# Altium schematic sheet STM32P100.SchDoc
size A3
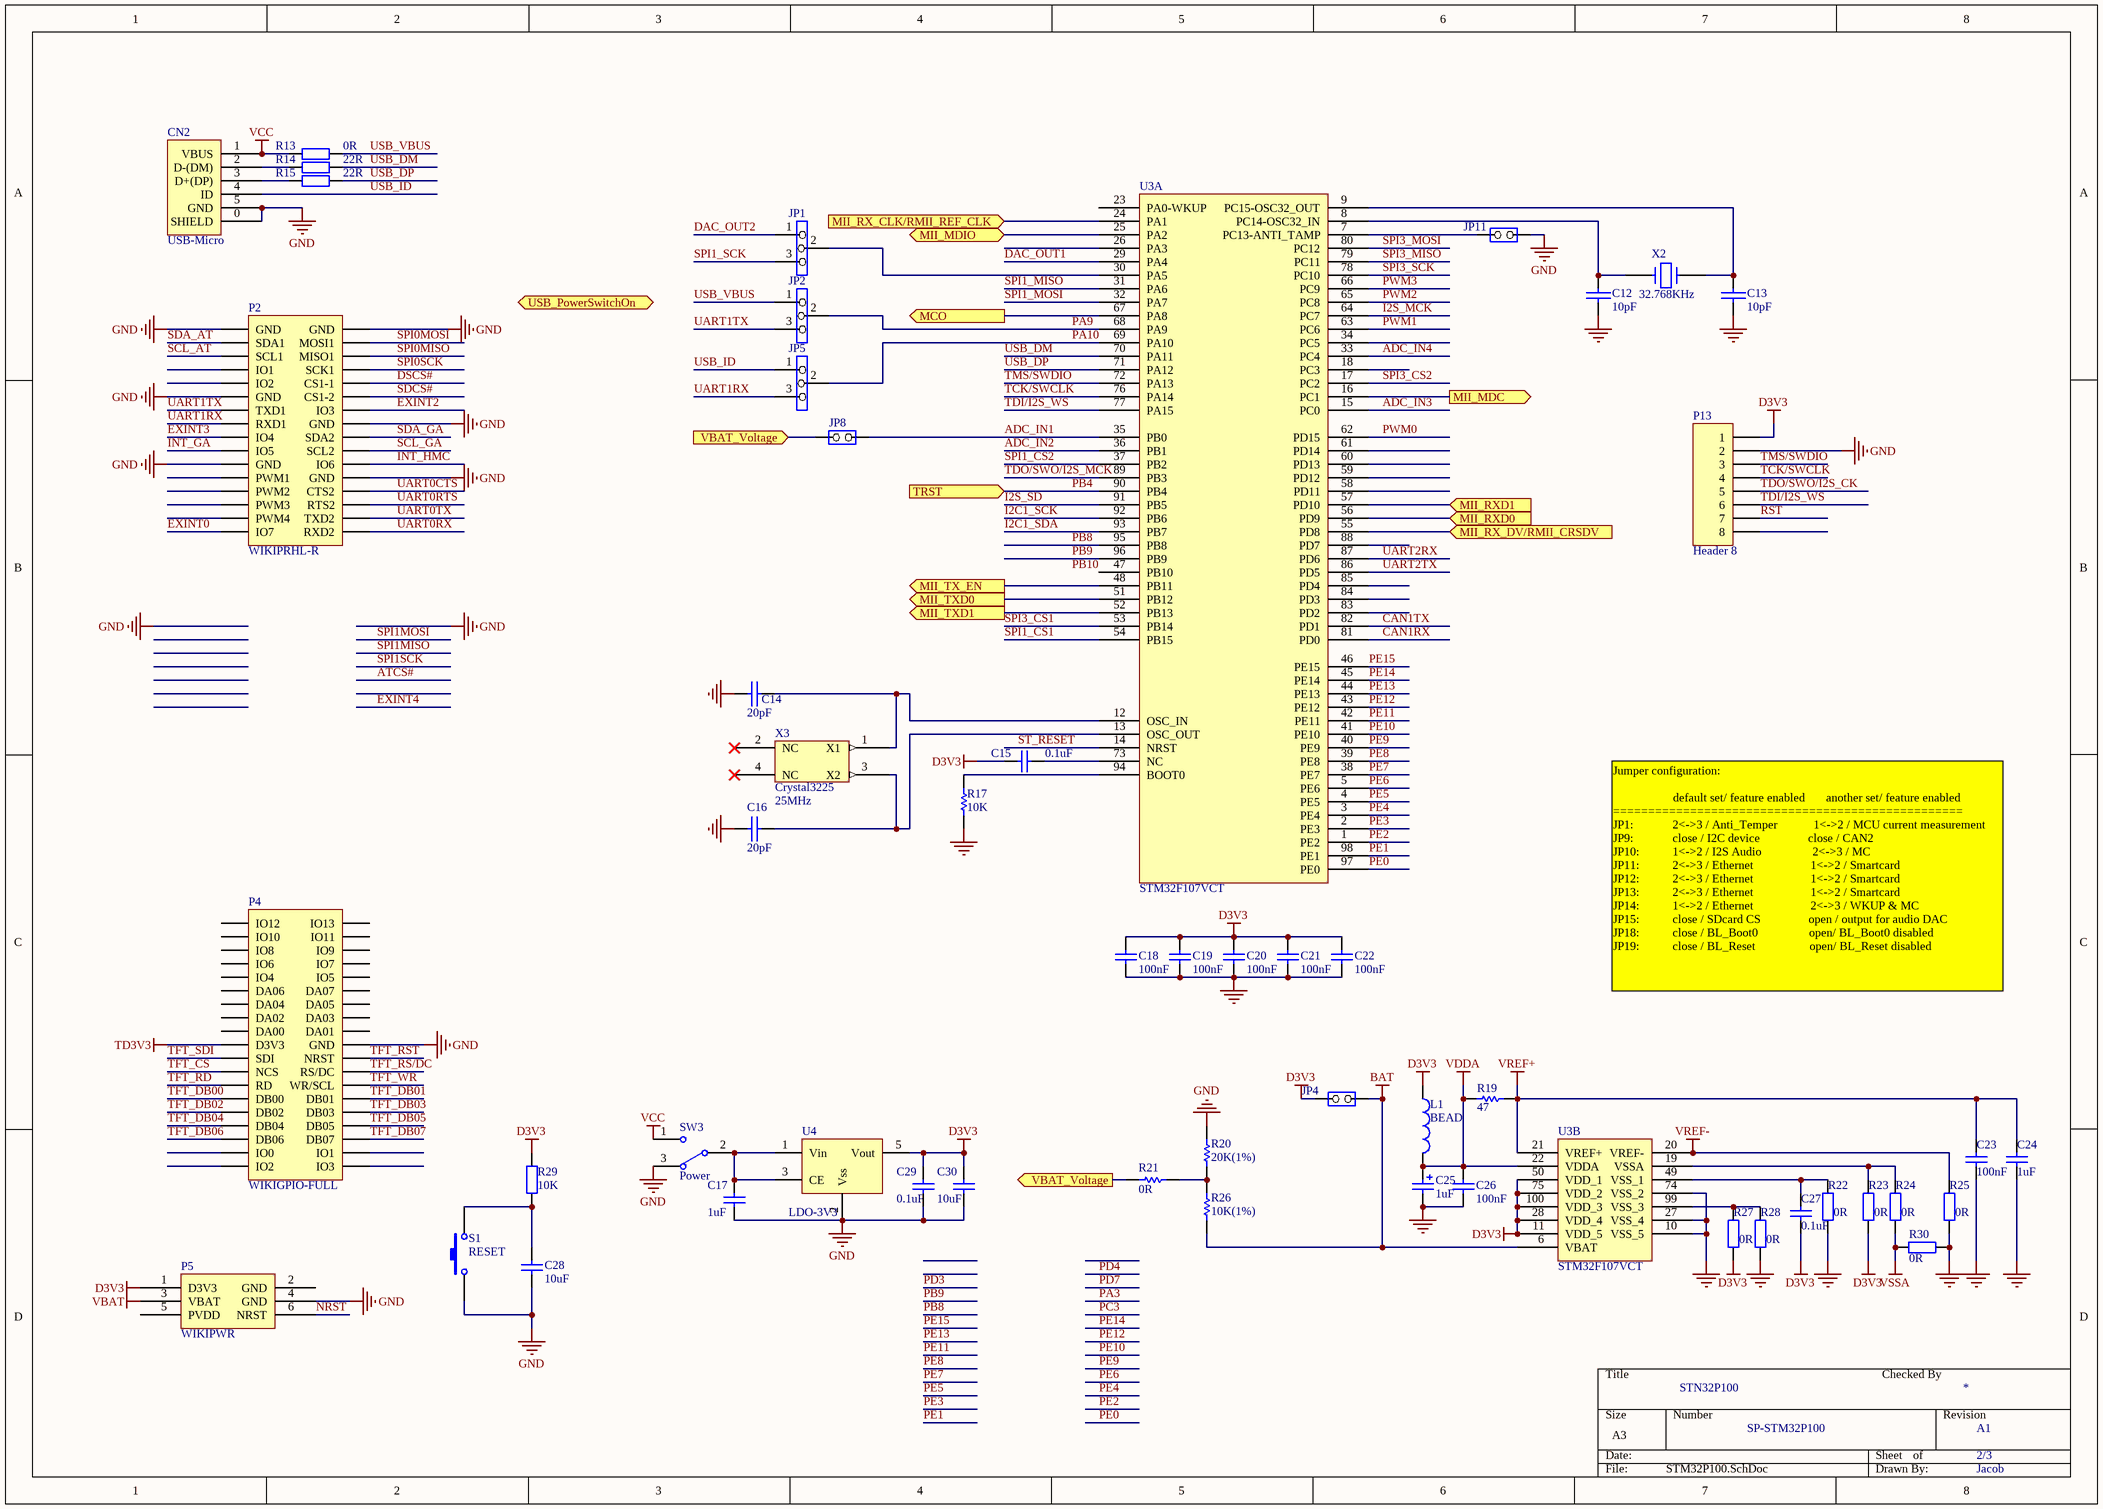
[diagram p0: STM32P100.SchDoc]

## Parts
C12  10pF  [0603M]
C13  10pF  [0603M]
C14  20pF  [0603M]
C15  0.1uF  [0603M]
C16  20pF  [0603M]
C17  1uF  [0805M]
C18  100nF  [0603M]
C19  100nF  [0603M]
C20  100nF  [0603M]
C21  100nF  [0603M]
C22  100nF  [0603M]
C23  100nF  [0603M]
C24  1uF  [0603M]
C25  1uF  [TAN-A]
C26  100nF  [0603M]
C27  0.1uF  [0603M]
C28  10uF  [0603L]
C29  0.1uF  [0603M]
C30  10uF  [0805M]
CN2  USB-Micro  [USB-MICRO-Female]
JP1  (no value)  [HDR1X3/2.00MM]
JP2  (no value)  [HDR1X3/2.00MM]
JP4  (no value)  [HDR1X2/2.00MM]
JP5  (no value)  [HDR1X3/2.00MM]
JP8  (no value)  [HDR1X2/2.00MM]
JP11  (no value)  [HDR1X2/2.00MM]
L1  BEAD  [0603L]
P2  WIKIPRHL-R  [WIKIPRHL-R]
P4  WIKIGPIO-FULL  [WIKIGPIO-FULL]
P5  WIKIPWR  [WIKIPWR]
P13  Header 8  [HDR1X8/2.54MM]
R13  0R  [0603M]
R14  22R  [0603M]
R15  22R  [0603M]
R17  10K  [0603M]
R19  47  [0603M]
R20  20K(1%)  [0603M]
R21  0R  [0603M]
R22  0R  [0603M]
R23  0R  [0603M]
R24  0R  [0603M]
R25  0R  [0603M]
R26  10K(1%)  [0603M]
R27  0R  [0603M]
R28  0R  [0603M]
R29  10K  [0603L]
R30  0R  [0603M]
S1  RESET  [KEY 6.1*4.0mm]
SW3  Power  [HDR1X3/2.54MM]
U3  STM32F107VCT  [LQFP100_N]  (parts A,B of 2)
U4  LDO-3V3  [SOT23-5]
X2  32.768KHz  [XTAL_32]
X3  Crystal3225  value 25MHz  [osc3225]

## Ports
MCO (out), MII_MDC (out), MII_MDIO (bidir), MII_RX_CLK/RMII_REF_CLK (in), MII_RX_DV/RMII_CRSDV (in), MII_RXD0 (in), MII_RXD1 (in), MII_TX_EN (out), MII_TXD0 (out), MII_TXD1 (out), TRST (in), USB_PowerSwitchOn (out), VBAT_Voltage (in), VBAT_Voltage (out)

## Nets
BAT: JP4.1(COMMON) R26.2 U3.6(VBAT)
D3V3: C15.1 C18.1 C19.1 C20.1 C21.1 C22.1 C27.1 C29.1 C30.1 JP4.2(NO) L1.1 P5.1(D3V3) P13.1 R23.2 R27.2 R29.2 U3.11(VDD_5) U3.28(VDD_4) U3.50(VDD_1) U3.75(VDD_2) U3.100(VDD_3) U4.5(Vout)
GND: C12.2 C13.2 C14.2 C16.2 C17.2 C18.2 C19.2 C20.2 C21.2 C22.2 C23.2 C24.2 C25.2 C26.2 C28.1 C29.2 C30.2 CN2.0(SHIELD) CN2.5(GND) JP11.1(COMMON) P2.1(GND) P2.2(GND) P2.11(GND) P2.16(GND) P2.21(GND) P2.24(GND) P4.20(GND) P5.4(GND) P13.2 R17.2 R20.1 R22.2 R25.2 R28.2 R30.1 S1.1 SW3.3 U3.10(VSS_5) U3.27(VSS_4) U3.74(VSS_2) U4.2(Vss)
TD3V3: P4.19(D3V3)
VBAT: P5.3(VBAT)
VCC: CN2.1(VBUS) R13.1 SW3.1
VDDA: C25.1 C26.1 L1.2 R19.2 U3.22(VDDA)
VREF+: C23.1 C24.1 R19.1 U3.21(VREF+)
VREF-: R25.1 U3.20(VREF-)
VSSA: R24.2 R30.2
ADC_IN1: JP8.1(COMMON) U3.35(PB0)
ADC_IN2: U3.36(PB1)
ADC_IN3: U3.15(PC0)
ADC_IN4: U3.33(PC4)
CAN1RX: U3.81(PD0)
CAN1TX: U3.82(PD1)
DAC_OUT1: U3.29(PA4)
DAC_OUT2: JP1.1
DSCS#: P2.10(CS1-1)
EXINT0: P2.31(IO7)
EXINT2: P2.14(IO3)
EXINT3: P2.17(IO4)
I2C1_SCK: U3.92(PB6)
I2C1_SDA: U3.93(PB7)
I2S_MCK: U3.64(PC7)
I2S_SD: U3.91(PB5)
INT_GA: P2.19(IO5)
INT_HMC: P2.22(IO6)
MCO: U3.67(PA8) ; port MCO
MII_MDC: U3.16(PC1) ; port MII_MDC
MII_MDIO: U3.25(PA2) ; port MII_MDIO
MII_RX_CLK/RMII_REF_CLK: U3.24(PA1) ; port MII_RX_CLK/RMII_REF_CLK
MII_RX_DV/RMII_CRSDV: U3.55(PD8) ; port MII_RX_DV/RMII_CRSDV
MII_RXD0: U3.56(PD9) ; port MII_RXD0
MII_RXD1: U3.57(PD10) ; port MII_RXD1
MII_TX_EN: U3.48(PB11) ; port MII_TX_EN
MII_TXD0: U3.51(PB12) ; port MII_TXD0
MII_TXD1: U3.52(PB13) ; port MII_TXD1
NRST: P5.6(NRST)
PA9: JP2.2 U3.68(PA9)
PA10: JP5.2 U3.69(PA10)
PB4: U3.90(PB4) ; port TRST
PB8: U3.95(PB8)
PB9: U3.96(PB9)
PE0: U3.97(PE0)
PE1: U3.98(PE1)
PE2: U3.1(PE2)
PE3: U3.2(PE3)
PE4: U3.3(PE4)
PE5: U3.4(PE5)
PE6: U3.5(PE6)
PE7: U3.38(PE7)
PE8: U3.39(PE8)
PE9: U3.40(PE9)
PE10: U3.41(PE10)
PE11: U3.42(PE11)
PE12: U3.43(PE12)
PE13: U3.44(PE13)
PE14: U3.45(PE14)
PE15: U3.46(PE15)
PWM0: U3.62(PD15)
PWM1: U3.63(PC6)
PWM2: U3.65(PC8)
PWM3: U3.66(PC9)
RST: P13.7
SCL_AT: P2.5(SCL1)
SCL_GA: P2.20(SCL2)
SDA_AT: P2.3(SDA1)
SDA_GA: P2.18(SDA2)
SDCS#: P2.12(CS1-2)
SPI0MISO: P2.6(MISO1)
SPI0MOSI: P2.4(MOSI1)
SPI0SCK: P2.8(SCK1)
SPI1_CS1: U3.54(PB15)
SPI1_CS2: U3.37(PB2)
SPI1_MISO: U3.31(PA6)
SPI1_MOSI: U3.32(PA7)
SPI1_SCK: JP1.3
SPI3_CS1: U3.53(PB14)
SPI3_CS2: U3.17(PC2)
SPI3_MISO: U3.79(PC11)
SPI3_MOSI: U3.80(PC12)
SPI3_SCK: U3.78(PC10)
ST_RESET: U3.14(NRST)
TCK/SWCLK: P13.4 U3.76(PA14)
TDI/I2S_WS: P13.6 U3.77(PA15)
TDO/SWO/I2S_CK: P13.5
TDO/SWO/I2S_MCK: U3.89(PB3)
TFT_CS: P4.23(NCS)
TFT_DB00: P4.27(DB00)
TFT_DB01: P4.28(DB01)
TFT_DB02: P4.29(DB02)
TFT_DB03: P4.30(DB03)
TFT_DB04: P4.31(DB04)
TFT_DB05: P4.32(DB05)
TFT_DB06: P4.33(DB06)
TFT_DB07: P4.34(DB07)
TFT_RD: P4.25(RD)
TFT_RS/DC: P4.24(RS/DC)
TFT_RST: P4.22(NRST)
TFT_SDI: P4.21(SDI)
TFT_WR: P4.26(WR/SCL)
TMS/SWDIO: P13.3 U3.72(PA13)
UART0CTS: P2.26(CTS2)
UART0RTS: P2.28(RTS2)
UART0RX: P2.32(RXD2)
UART0TX: P2.30(TXD2)
UART1RX: JP5.3 P2.15(RXD1)
UART1TX: JP2.3 P2.13(TXD1)
UART2RX: U3.87(PD6)
UART2TX: U3.86(PD5)
USB_DM: R14.2 U3.70(PA11)
USB_DP: R15.2 U3.71(PA12)
USB_ID: CN2.4(ID) JP5.1
USB_VBUS: JP2.1 R13.2
VBAT_Voltage: JP8.2(NO) R21.1 ; port VBAT_Voltage
NetC12_1: C12.1 U3.8(PC14-OSC32_IN) X2.2
NetC13_1: C13.1 U3.9(PC15-OSC32_OUT) X2.1
NetC14_1: C14.1 U3.12(OSC_IN) X3.1(X1)
NetC15_2: C15.2 U3.73(NC)
NetC16_1: C16.1 U3.13(OSC_OUT) X3.3(X2)
NetC17_1: C17.1 SW3.2 U4.1(Vin) U4.3(CE)
NetC27_2: C27.2 R22.1 U3.49(VSS_1)
NetC28_2: C28.2 R29.1 S1.2
NetCN2_2: CN2.2(D-(DM)) R14.1
NetCN2_3: CN2.3(D+(DP)) R15.1
NetJP1_2: JP1.2 U3.30(PA5)
NetJP11_2: JP11.2(NO) U3.7(PC13-ANTI_TAMP)
NetR17_1: R17.1 U3.94(BOOT0)
NetR20_2: R20.2 R21.2 R26.1
NetR23_1: R23.1 R24.1 U3.19(VSSA)
NetR27_1: R27.1 R28.1 U3.99(VSS_3)

Not connected (* = marked no-connect by the designer): P2 7(IO1) 9(IO2) 23(PWM1) 25(PWM2) 27(PWM3) 29(PWM4); P4 1(IO12) 2(IO13) 3(IO10) 4(IO11) 5(IO8) 6(IO9) 7(IO6) 8(IO7) 9(IO4) 10(IO5) 11(DA06) 12(DA07) 13(DA04) 14(DA05) 15(DA02) 16(DA03) 17(DA00) 18(DA01) 35(IO0) 36(IO1) 37(IO2) 38(IO3); P5 2(GND) 5(PVDD); P13 8; U3 18(PC3) 23(PA0-WKUP) 26(PA3) 34(PC5) 47(PB10) 58(PD11) 59(PD12) 60(PD13) 61(PD14) 83(PD2) 84(PD3) 85(PD4) 88(PD7); U4 4(NC); X3 2(NC)* 4(NC)*

## Notes on the sheet
- Jumper configuration:
  default set/ feature enabled       another set/ feature enabled
  ==================================================
  JP1:             2<->3 / Anti_Temper            1<->2 / MCU current measurement
  JP9:             close / I2C device                close / CAN2
  JP10:           1<->2 / I2S Audio                 2<->3 / MC
  JP11:           2<->3 / Ethernet                   1<->2 / Smartcard
  JP12:           2<->3 / Ethernet                   1<->2 / Smartcard
  JP13:           2<->3 / Ethernet                   1<->2 / Smartcard
  JP14:           1<->2 / Ethernet                   2<->3 / WKUP & MC
  JP15:           close / SDcard CS                open / output for audio DAC
  JP18:           close / BL_Boot0                 open/ BL_Boot0 disabled
  JP19:           close / BL_Reset                  open/ BL_Reset disabled
- STN32P100
- Checked By
- *
- SP-STM32P100
- A1
- 2/3
- Jacob
- Labels drawn without touching a wire or pin: PB10

## Library data of the parts
C12-C14 C16 = CAP: Capacitor
C15 C17 C27-C30 = Cap: Capacitor; Published: 8-Jun-2000; LatestRevisionDate: 17-Jul-2002; LatestRevisionNote: Re-released for DXP Platform.; PackageReference: RAD-0.3
  C15 C27: Value: 0.1uF
  C17: Publisher: Altium Limited; Value: 1uF
  C28 C30: Publisher: Altium Limited; Value: 10uF
  C29: Publisher: Altium Limited; Value: 0.1uF
C18-C24 C26 = Cap: Capacitor; Value: 10nF; Published: 8-Jun-2000; Revision: July-2002: Re-released for DXP Platform.; Publisher: Altium Limited
C25 = Cap Pol1: Polarized Capacitor (Radial); Value: 10uF; Published: 8-Jun-2000; Revision: July-2002: Re-released for DXP Platform.; Publisher: Altium Limited
JP1 JP2 JP5 = Jumper3
JP4 JP8 JP11 = JP2
L1 = Inductor: Value: 100uH; Published: 8-Jun-2000; Revision: July-2002: Re-released for DXP Platform.; Publisher: Altium Limited
P2 = WIKIPRHL-R: Header, 16-Pin, Dual row; LatestRevisionDate: 17-Jul-2002; LatestRevisionNote: Re-released for DXP Platform.; Publisher: Altium Limited
P4 = WIKIGPIO-FULL: Header, 19-Pin, Dual row; LatestRevisionDate: 17-Jul-2002; LatestRevisionNote: Re-released for DXP Platform.; Publisher: Altium Limited
P5 = WIKIPWR: PWR HDR
P13 = Header 8: Header, 8-Pin; LatestRevisionDate: 17-Jul-2002; LatestRevisionNote: Re-released for DXP Platform.; Publisher: Altium Limited
R13-R15 R22-R25 R27-R30 = Res2: Resistor; Published: 8-Jun-2000; LatestRevisionDate: 17-Jul-2002; LatestRevisionNote: Re-released for DXP Platform.; PackageReference: AXIAL-0.4; Publisher: Altium Limited
  R13 R22-R25 R27 R28 R30: Value: 0R
  R14 R15: Value: 22R
  R29: Value: 10K
R17 R20 R21 R26 = res1: Resistor; Value: 1K; Published: 8-Jun-2000; Revision: July-2002: Re-released for DXP Platform.; Publisher: Altium Limited
R19 = Res1: Resistor; Value: 1K; Published: 8-Jun-2000; Revision: July-2002: Re-released for DXP Platform.; Publisher: Altium Limited
S1 = SW-PB: Switch; Published: 24-Mar-1999; LatestRevisionDate: 17-Jul-2002; LatestRevisionNote: Re-released for DXP Platform.; PackageReference: SPST-2; Publisher: Altium Limited
SW3 = SW-SPDT: SPDT Subminiature Toggle Switch, Right Angle Mounting, Vertical Actuation; Revision 1: Jul-2002: Re-released for DXP Platform.; Revision 2: 17-Dec-2003: Schematic revised, PCB Footprint replaced.; Published: 24-Mar-1999; Datasheet: Latest Revision: 05-Dec-2000; Publisher: Altium Limited
U3 = BARRACUDA_256K
U4 = XC6219: LDO
X2 = CRYSTAL
X3 = Crystal322